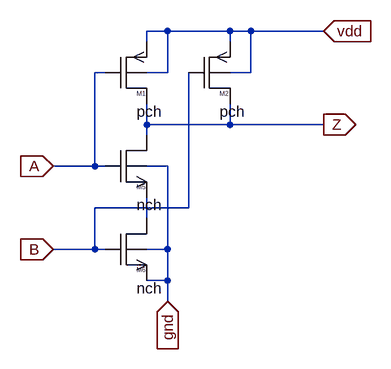
[diagram p0: schematic mynand2.asc]
mynand2.asc, the LTspice schematic file:
Version 4
SHEET 1 880 680
WIRE 128 -240 96 -240
WIRE 224 -240 128 -240
WIRE 256 -240 224 -240
WIRE 368 -240 256 -240
WIRE 96 -224 96 -240
WIRE 224 -224 224 -240
WIRE 32 -176 16 -176
WIRE 128 -176 128 -240
WIRE 128 -176 96 -176
WIRE 256 -176 256 -240
WIRE 256 -176 224 -176
WIRE 96 -96 96 -128
WIRE 224 -96 224 -128
WIRE 224 -96 96 -96
WIRE 368 -96 224 -96
WIRE 96 -80 96 -96
WIRE 16 -32 16 -176
WIRE 16 -32 -48 -32
WIRE 32 -32 16 -32
WIRE 128 -32 96 -32
WIRE 160 32 160 -176
WIRE 160 32 16 32
WIRE 96 48 96 16
WIRE 16 96 16 32
WIRE 16 96 -48 96
WIRE 32 96 16 96
WIRE 128 96 128 -32
WIRE 128 96 96 96
WIRE 128 144 128 96
WIRE 128 144 96 144
WIRE 128 176 128 144
FLAG -48 -32 A
IOPIN -48 -32 In
FLAG -48 96 B
IOPIN -48 96 In
FLAG 368 -96 Z
IOPIN 368 -96 Out
FLAG 128 176 gnd
IOPIN 128 176 In
FLAG 368 -240 vdd
IOPIN 368 -240 In
SYMBOL pmos4 32 -176 R0
WINDOW 3 48 60 Left 2
SYMATTR InstName M1
SYMATTR Value pch
SYMATTR Value2 l=2u w=18u
SYMBOL pmos4 160 -176 R0
WINDOW 3 48 60 Left 2
SYMATTR InstName M2
SYMATTR Value pch
SYMATTR Value2 l=2u w=18u
SYMBOL nmos4 32 -32 R0
WINDOW 3 48 60 Left 2
SYMATTR InstName M5
SYMATTR Value nch
SYMATTR Value2 l=2u w=6u
SYMBOL nmos4 32 96 R0
WINDOW 3 48 60 Left 2
SYMATTR InstName M6
SYMATTR Value nch
SYMATTR Value2 l=2u w=6u

The netlist it stands for:
* mynand2.asc
M1 Z A vdd vdd pch l=2u w=18u
M2 Z B vdd vdd pch l=2u w=18u
M5 Z A N001 gnd nch l=2u w=6u
M6 N001 B gnd gnd nch l=2u w=6u
.model NMOS NMOS
.model PMOS PMOS
.lib standard.mos
.backanno
.end